# Altium schematic sheet featherULP.SchDoc
size 282 x 200 mm; COMPANY: ADAFRUIT INDUSTRIES; DRAWN: KTOWN; REV: B
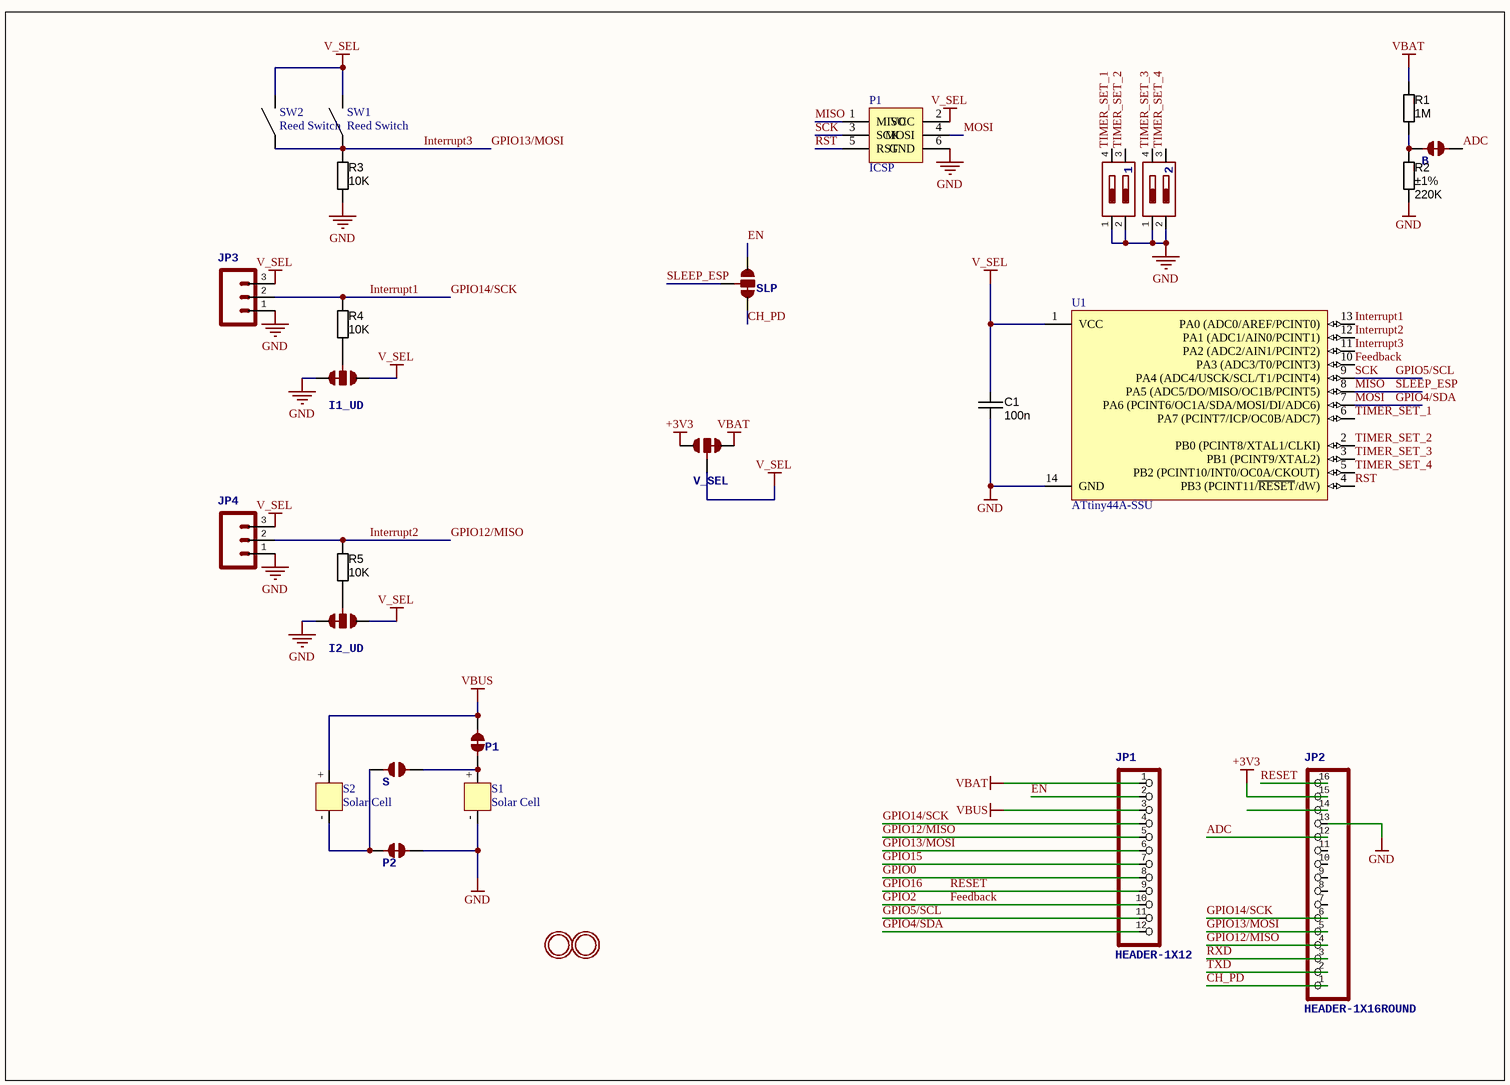
[diagram p0: featherULP.SchDoc]

## Parts
(Parts that share a designator on the sheet are numbered #1, #2 ... from top to bottom, then left to right.)
1  SMD dip switch 2 positions  [CHS-02A]  (value not drawn)
2  SMD dip switch 2 positions  [CHS-02A]  (value not drawn)
B  JUMPER-PAD-2-NC_BY_TRACENO_SILK  [PAD-JUMPER-2-NC_BY_TRACE_NO_SILK]  (value not drawn)  (net tie, no BOM)
C1  value 100n  [CAPC1608X90N]  (hidden comment: approved sub OK)
I1_UD  JUMPER-PAD-3-2OF3_NC_BY_TRACE_SMALL  [PAD-JUMPER-3-2OF3_NC_BY_TRACE_YES_SILK_FULL_BOX]  (value not drawn)  (net tie, no BOM)
I2_UD  JUMPER-PAD-3-2OF3_NC_BY_TRACE_SMALL  [PAD-JUMPER-3-2OF3_NC_BY_TRACE_YES_SILK_FULL_BOX]  (value not drawn)  (net tie, no BOM)
JP1  HEADER-1X12  [1X12_ROUND]
JP2  HEADER-1X16ROUND  [1X16_ROUND]
JP3  Header 3Standard 3-pin 0.1" header. Use with straight break away headers (SKU : PRT-00116), right angle break away headers (PRT-00553), swiss pins (PRT-00743), machine pins (PRT-00117), and female headers (PRT-00115). Molex polarized connector foot print use with SKU : PRT-08232 with associated crimp pins and housings.  [1X03]  (value not drawn)
JP4  Header 3Standard 3-pin 0.1" header. Use with straight break away headers (SKU : PRT-00116), right angle break away headers (PRT-00553), swiss pins (PRT-00743), machine pins (PRT-00117), and female headers (PRT-00115). Molex polarized connector foot print use with SKU : PRT-08232 with associated crimp pins and housings.  [1X03]  (value not drawn)
P1#1  ICSP  [ICSP Pads - SMD]
P1#2  JUMPER-PAD-2-NC_BY_TRACENO_SILK  [PAD-JUMPER-2-NC_BY_TRACE_NO_SILK]  (value not drawn)  (net tie, no BOM)
P2  JUMPER-PAD-2-NC_BY_TRACENO_SILK  [PAD-JUMPER-2-NC_BY_TRACE_NO_SILK]  (value not drawn)  (net tie, no BOM)
R1  value 1M  [RESC2012X70N]  (hidden comment: Thick Film)
R2  value 220K  Tolerance: ±1%  [RESC2012X70N]  (hidden comment: Thick Film)
R3  value 10K  [RESC1608X55N]  (hidden comment: Thick Film)
R4  value 10K  [RESC1608X55N]  (hidden comment: Thick Film)
R5  value 10K  [RESC1608X55N]  (hidden comment: Thick Film)
S  JUMPER-PAD-2-NO  [PAD-JUMPER-2-NO_NO_SILK]  (value not drawn)  (net tie, no BOM)
S1  Solar Cell  [Solar Cell IXYS  KXOB22-01X8L-ND]
S2  Solar Cell  [Solar Cell IXYS  KXOB22-01X8L-ND]
SLP  JUMPER-PAD-3-2OF3_NC_BY_TRACE_SMALL  [PAD-JUMPER-3-2OF3_NC_BY_TRACE_YES_SILK_FULL_BOX]  (value not drawn)  (net tie, no BOM)
SW1  Reed Switch  [Reed Switch MDSM-4]
SW2  Reed Switch  [Reed Switch MDSM-4]
U1  ATtiny44A-SSU  [14S1_N]
U$31  MOUNTINGHOLE2.5  [MOUNTINGHOLE_2.5_PLATED]  (value not drawn)
U$32  MOUNTINGHOLE2.5  [MOUNTINGHOLE_2.5_PLATED]  (value not drawn)
V_SEL  JUMPER-PAD-3-2OF3_NC_BY_TRACE_SMALL  [PAD-JUMPER-3-2OF3_NC_BY_TRACE_YES_SILK_FULL_BOX]  (value not drawn)  (net tie, no BOM)

## Nets
+3V3: JP2.15 V_SEL.1
GND: 1.1(P$1) 1.2(P$2) 2.1(P$1) 2.2(P$2) C1.2 I1_UD.3 I2_UD.3 JP2.13 JP3.1 JP4.1 P1#1.6(GND) P2.2 R2.2 R3.2 S1.- U1.14(GND)
V_SEL: C1.1 I1_UD.1 I2_UD.1 JP3.3 JP4.3 P1#1.2(VCC) SW1.1 SW2.1 U1.1(VCC) V_SEL.2
VBAT: JP1.1 R1.1 V_SEL.3
VBUS: JP1.3 P1#2.2 S2.+
ADC: B.2 JP2.12
CH_PD: JP2.1 SLP.3
EN: JP1.2 SLP.1
Feedback: JP1.10 U1.10(PA3_(ADC3/T0/PCINT3))  [also labelled GPIO2]
GPIO0: JP1.8
GPIO4/SDA: JP1.12 P1#1.4(MOSI) U1.7(PA6_(PCINT6/OC1A/SDA/MOSI/DI/ADC6))  [also labelled MOSI]
GPIO5/SCL: JP1.11 P1#1.3(SCK) U1.9(PA4_(ADC4/USCK/SCL/T1/PCINT4))  [also labelled SCK]
GPIO12/MISO: JP1.5 JP2.4 JP4.2 R5.1 U1.12(PA1_(ADC1/AIN0/PCINT1))  [also labelled Interrupt2]
GPIO13/MOSI: JP1.6 JP2.5 R3.1 SW1.0 SW2.0 U1.11(PA2_(ADC2/AIN1/PCINT2))  [also labelled Interrupt3]
GPIO14/SCK: JP1.4 JP2.6 JP3.2 R4.1 U1.13(PA0_(ADC0/AREF/PCINT0))  [also labelled Interrupt1]
GPIO15: JP1.7
GPIO16: JP1.9 JP2.16  [also labelled RESET]
MISO: P1#1.1(MISO) SLP.2 U1.8(PA5_(ADC5/DO/MISO/OC1B/PCINT5))  [also labelled SLEEP_ESP]
RST: P1#1.5(RST) U1.4(PB3_(PCINT11/~{RESET}/dW))
RXD: JP2.3
TIMER_SET_1: 1.4(P$4) U1.6(PA7_(PCINT7/ICP/OC0B/ADC7))
TIMER_SET_2: 1.3(P$3) U1.2(PB0_(PCINT8/XTAL1/CLKI))
TIMER_SET_3: 2.4(P$4) U1.3(PB1_(PCINT9/XTAL2))
TIMER_SET_4: 2.3(P$3) U1.5(PB2_(PCINT10/INT0/OC0A/CKOUT))
TXD: JP2.2
NetB_1: B.1 R1.2 R2.1
NetI1_UD_2: I1_UD.2 R4.2
NetI2_UD_2: I2_UD.2 R5.2
NetP1#2_1: P1#2.1 S.2 S1.+
NetP2_1: P2.1 S.1 S2.-

Not connected (* = marked no-connect by the designer): JP2 7 8 9 10 11 14

## Library data of the parts
1 2 = 2-POS-DIP: PROD_ID: SWCH-12372
C1 = CAPC_100n_0603_X7R_50V_10%: Capacitor SMD Cer 100nF 10% 50V X7R 0603; Manufacturer 1: AVX Corporation; Manufacturer Part Number 1: 06035C104KAT2A; Ratings: 50V; X7R; Material: ceramic; SCDType: spec; Manufacturer 2: TDK Corporation; Manufacturer Part Number 2: C1608X7R1H104K; Package / Case: 0603 (1608 Metric); Tolerance: ±10%; Supplier 1: Digi-Key; Supplier Part Number 1: 478-5052-1-ND; ComponentLink1URL: http://www.avx.com/docs/Catalogs/cx7r.pdf; ComponentLink1Description: http://www.avx.com/docs/Catalogs/cx7r.pdf; Supplier 2: Digi-Key; Supplier Part Number 2: 445-1314-1-ND; ComponentLink2URL: http://product.tdk.com/capacitor/mlcc/en/documents/mlcc_commercial_general_en.pdf; ComponentLink2Description: http://product.tdk.com/capacitor/mlcc/en/documents/mlcc_commercial_general_en.pdf
JP1 = HEADER-1X12: COMPANY: ADAFRUIT INDUSTRIES; DRAWN: KTOWN; REV: B
JP2 = HEADER-1X16ROUND: PIN HEADER; COMPANY: ADAFRUIT INDUSTRIES; DRAWN: KTOWN; REV: B
JP3 JP4 = M03PTH
P1#1 = Header 3X2: Header, 3-Pin, Dual row; LatestRevisionDate: 17-Jul-2002; LatestRevisionNote: Re-released for DXP Platform.; Publisher: Altium Limited
R1 = RES_1M_0805_5%: Resistor SMD chip 1M Ohm 0.125W 5% 0805; Manufacturer 1: Vishay/Dale; Manufacturer Part Number 1: CRCW08051M00JNEA; Ratings: 1/8W; SCDType: spec; Tolerance: ±5%; Package / Case: 0805 (2012 metric); Supplier 1: Digi-Key; Supplier Part Number 1: 541-1.0MACT-ND
R2 = RES_205K_0805_1%: Resistor SMD chip 205k Ohm 0.125W 1% 0805; Manufacturer 1: Vishay/Dale; Manufacturer Part Number 1: CRCW0805205KFKEA; Ratings: 1/8W; SCDType: spec; Package / Case: 0805 (2012 metric); Supplier 1: Digi-Key; Supplier Part Number 1: 541-205KCCT-ND
R3-R5 = RES_10K_0603_5%: Resistor SMD chip 10k Ohm 0.1W 5% 0603; Manufacturer 1: Yageo; Manufacturer Part Number 1: RC0603JR-0710KL; Ratings: 1/10 W; SCDType: spec; Package / Case: 0603 (1608 metric); Tolerance: ±5%; Material: Thick Film; Supplier 1: Digi-Key; Supplier Part Number 1: 311-10KGRCT-ND; Supplier 2: Digi-Key; Supplier Part Number 2: 541-10KGCT-ND; Manufacturer 2: Vishay Dale; Manufacturer Part Number 2: CRCW060310K0JNEA; ComponentLink2URL: http://www.vishay.com/doc?20035; ComponentLink2Description: http://www.vishay.com/doc?20035; ComponentLink1URL: http://www.yageo.com/documents/recent/PYu-RC0603_51_RoHS_L_4.pdf; ComponentLink1Description: http://www.yageo.com/documents/recent/PYu-RC0603_51_RoHS_L_4.pdf
U1 = ATtiny44A-SSU: 8-bit AVR Microcontroller,  20MHz, 1.8-5.5V, 4KB Flash, 256 Bytes EEPROM, 256 Bytes SRAM, 14-pin SOIC, Industrial Grade (-40°C to 85°C), Pb-Free; DatasheetVersion: revD, Apr-2011; PackageVersion: revA, Feb-2002; PackageReference: 14S1; PackageDescription: 14-Lead, 0.150” Wide Body, Plastic Gull Wing Small Outline Package (SOIC); Code_JEDEC: MS-012-AB; Code_IPC: SOIC127P600-14; ComponentLink1Description: Manufacturer URL; ComponentLink1URL: http://www.atmel.com/; ComponentLink2Description: ATtiny24A/44A/84A Datasheet; ComponentLink2URL: http://www.atmel.com/dyn/resources/prod_documents/doc8183.pdf; ComponentLink3Description: ATtiny24A/44A/84A Summary; ComponentLink3URL: http://www.atmel.com/dyn/resources/prod_documents/8183S.pdf
U$31 U$32 = MOUNTINGHOLE2.5: Mounting Hole   For #2 screws (0.086"/2.18mm width, 0.094"/2.4mm hole) use 2.5mm; BOM: EXCLUDE; COMPANY: ADAFRUIT INDUSTRIES; DRAWN: KTOWN; REV: B
S1 S2 = Solar Cell: Supplier 1: Digi-Key; Supplier Part Number 1: KXOB22-01X8L-ND
SW1 SW2 = Reed Switch: Supplier 1: Digi-Key; Supplier Part Number 1: HE151CT-ND